# Altium schematic sheet sdcard.SchDoc: MCB | MicroSD card
size A4; DocumentNumber: 11; SheetNumber: 11; SheetTotal: 12
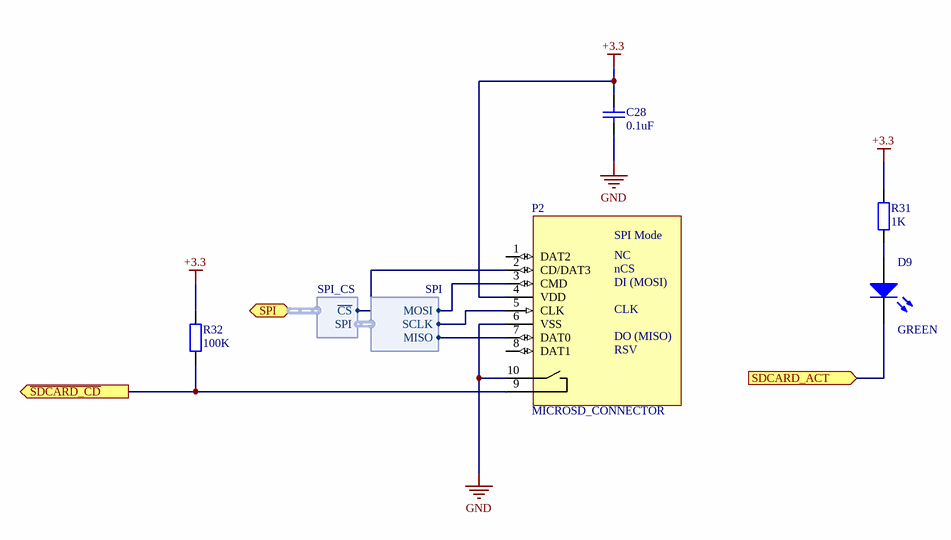
[diagram p0: sdcard.SchDoc]

## Parts
C28  value 0.1uF  [C0603]  (hidden comment: Cap)
D9  value GREEN  [LGQ971]
P2  MICROSD_CONNECTOR  [49225-0821]
R31  value 1K  [R0603]  (hidden comment: Res)
R32  value 100K  [R0603]  (hidden comment: Res)

## Ports
SDCARD_ACT (in), SPI (harness SPI_CS), ~{SDCARD_CD} (out)

## Harnesses
SPI_CS: ~{CS}, SPI
SPI: MISO, MOSI, SCLK

## Nets
+3.3: C28.1 P2.4(VDD) R31.2 R32.2
GND: C28.2 P2.6(VSS) P2.10
~{SDCARD_CD}: P2.9 R32.1 ; port ~{SDCARD_CD}
SDCARD_ACT: D9.2(K) ; port SDCARD_ACT
NetD9_1: D9.1(A) R31.1
NetP2_2: P2.2(CD/DAT3) ; port SPI.~{CS}
NetP2_3: P2.3(CMD) ; harness SPI.MOSI
NetP2_5: P2.5(CLK) ; harness SPI.SCLK
NetP2_7: P2.7(DAT0) ; harness SPI.MISO

Not connected (* = marked no-connect by the designer): P2 1(DAT2) 8(DAT1)

## Notes on the sheet
- (in symbol MICROSD_CONNECTOR) SPI Mode; NC; nCS; DI (MOSI); DO (MISO); RSV

## Library data of the parts
C28 = Cap: Capacitor; farnell: 1759122
D9 = LED2: Typical RED, GREEN, YELLOW, AMBER GaAs LED; farnell: 1226372
P2 = MICROSD_CONNECTOR: MOLEX - 49225-0821 - CONNECTOR, MICRO SD, PUSH/PUSH, 8; pinout checked: yes; farnell: 1366700
R31 R32 = Res2: Resistor
  R31: farnell: 9330380
  R32: farnell: 9330402